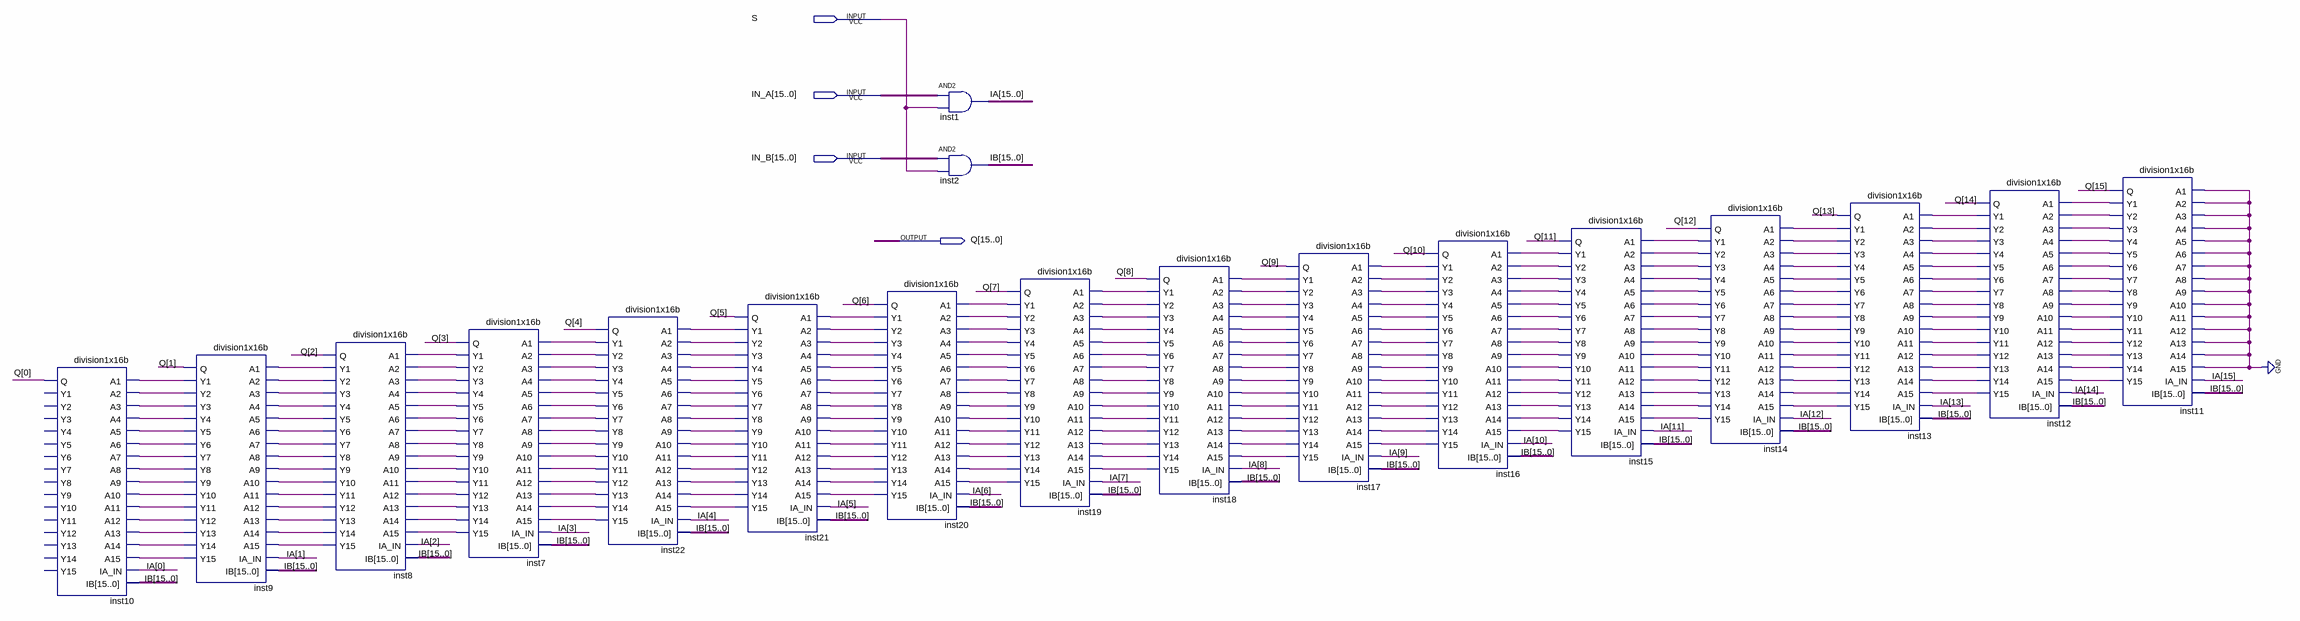
[diagram p0: schematic sheet]
// Quartus schematic division.bdf as structural Verilog: 18 symbols, 4 pins
module division (
  input  S,
  input  [15:0] IN_A,
  input  [15:0] IN_B,
  output [15:0] Q
);

  wire inst7_y1, inst7_y2, inst7_y3, inst7_y4, inst7_y5, inst7_y6, inst7_y7, inst7_y8, inst7_y9, inst7_y10,
       inst7_y11, inst7_y12, inst7_y13, inst7_y14, inst7_y15, inst8_y1, inst8_y2, inst8_y3, inst8_y4,
       inst8_y5, inst8_y6, inst8_y7, inst8_y8, inst8_y9, inst8_y10, inst8_y11, inst8_y12, inst8_y13,
       inst8_y14, inst8_y15, inst9_y1, inst9_y2, inst9_y3, inst9_y4, inst9_y5, inst9_y6, inst9_y7, inst9_y8,
       inst9_y9, inst9_y10, inst9_y11, inst9_y12, inst9_y13, inst9_y14, inst9_y15, inst11_y1, inst11_y2,
       inst11_y3, inst11_y4, inst11_y5, inst11_y6, inst11_y7, inst11_y8, inst11_y9, inst11_y10, inst11_y11,
       inst11_y12, inst11_y13, inst11_y14, inst11_y15, inst12_y1, inst12_y2, inst12_y3, inst12_y4, inst12_y5,
       inst12_y6, inst12_y7, inst12_y8, inst12_y9, inst12_y10, inst12_y11, inst12_y12, inst12_y13,
       inst12_y14, inst12_y15, inst13_y1, inst13_y2, inst13_y3, inst13_y4, inst13_y5, inst13_y6, inst13_y7,
       inst13_y8, inst13_y9, inst13_y10, inst13_y11, inst13_y12, inst13_y13, inst13_y14, inst13_y15,
       inst14_y1, inst14_y2, inst14_y3, inst14_y4, inst14_y5, inst14_y6, inst14_y7, inst14_y8, inst14_y9,
       inst14_y10, inst14_y11, inst14_y12, inst14_y13, inst14_y14, inst14_y15, inst15_y1, inst15_y2,
       inst15_y3, inst15_y4, inst15_y5, inst15_y6, inst15_y7, inst15_y8, inst15_y9, inst15_y10, inst15_y11,
       inst15_y12, inst15_y13, inst15_y14, inst15_y15, inst16_y1, inst16_y2, inst16_y3, inst16_y4, inst16_y5,
       inst16_y6, inst16_y7, inst16_y8, inst16_y9, inst16_y10, inst16_y11, inst16_y12, inst16_y13,
       inst16_y14, inst16_y15, inst17_y1, inst17_y2, inst17_y3, inst17_y4, inst17_y5, inst17_y6, inst17_y7,
       inst17_y8, inst17_y9, inst17_y10, inst17_y11, inst17_y12, inst17_y13, inst17_y14, inst17_y15,
       inst18_y1, inst18_y2, inst18_y3, inst18_y4, inst18_y5, inst18_y6, inst18_y7, inst18_y8, inst18_y9,
       inst18_y10, inst18_y11, inst18_y12, inst18_y13, inst18_y14, inst18_y15, inst19_y1, inst19_y2,
       inst19_y3, inst19_y4, inst19_y5, inst19_y6, inst19_y7, inst19_y8, inst19_y9, inst19_y10, inst19_y11,
       inst19_y12, inst19_y13, inst19_y14, inst19_y15, inst20_y1, inst20_y2, inst20_y3, inst20_y4, inst20_y5,
       inst20_y6, inst20_y7, inst20_y8, inst20_y9, inst20_y10, inst20_y11, inst20_y12, inst20_y13,
       inst20_y14, inst20_y15, inst21_y1, inst21_y2, inst21_y3, inst21_y4, inst21_y5, inst21_y6, inst21_y7,
       inst21_y8, inst21_y9, inst21_y10, inst21_y11, inst21_y12, inst21_y13, inst21_y14, inst21_y15,
       inst22_y1, inst22_y2, inst22_y3, inst22_y4, inst22_y5, inst22_y6, inst22_y7, inst22_y8, inst22_y9,
       inst22_y10, inst22_y11, inst22_y12, inst22_y13, inst22_y14, inst22_y15;
  wire [15:0] IA, IB;

  division1x16b inst10 (
    .A1(inst9_y1), .A2(inst9_y2), .A3(inst9_y3), .A4(inst9_y4), .A5(inst9_y5), .A6(inst9_y6), .A7(inst9_y7),
    .A8(inst9_y8), .A9(inst9_y9), .A10(inst9_y10), .A11(inst9_y11), .A12(inst9_y12), .A13(inst9_y13),
    .A14(inst9_y14), .A15(inst9_y15), .IA_IN(IA[0]), .IB(IB), .Q(Q[0]));  // open: Y7, Y6, Y5, Y4, Y3, Y2, Y1, Y9, Y8, Y10, Y11, Y12, Y13, Y14, Y15
  division1x16b inst9 (
    .A1(inst8_y1), .A2(inst8_y2), .A3(inst8_y3), .A4(inst8_y4), .A5(inst8_y5), .A6(inst8_y6), .A7(inst8_y7),
    .A8(inst8_y8), .A9(inst8_y9), .A10(inst8_y10), .A11(inst8_y11), .A12(inst8_y12), .A13(inst8_y13),
    .A14(inst8_y14), .A15(inst8_y15), .IA_IN(IA[1]), .IB(IB), .Q(Q[1]), .Y7(inst9_y7), .Y6(inst9_y6),
    .Y5(inst9_y5), .Y4(inst9_y4), .Y3(inst9_y3), .Y2(inst9_y2), .Y1(inst9_y1), .Y9(inst9_y9), .Y8(inst9_y8),
    .Y10(inst9_y10), .Y11(inst9_y11), .Y12(inst9_y12), .Y13(inst9_y13), .Y14(inst9_y14), .Y15(inst9_y15));
  division1x16b inst8 (
    .A1(inst7_y1), .A2(inst7_y2), .A3(inst7_y3), .A4(inst7_y4), .A5(inst7_y5), .A6(inst7_y6), .A7(inst7_y7),
    .A8(inst7_y8), .A9(inst7_y9), .A10(inst7_y10), .A11(inst7_y11), .A12(inst7_y12), .A13(inst7_y13),
    .A14(inst7_y14), .A15(inst7_y15), .IA_IN(IA[2]), .IB(IB), .Q(Q[2]), .Y7(inst8_y7), .Y6(inst8_y6),
    .Y5(inst8_y5), .Y4(inst8_y4), .Y3(inst8_y3), .Y2(inst8_y2), .Y1(inst8_y1), .Y9(inst8_y9), .Y8(inst8_y8),
    .Y10(inst8_y10), .Y11(inst8_y11), .Y12(inst8_y12), .Y13(inst8_y13), .Y14(inst8_y14), .Y15(inst8_y15));
  division1x16b inst7 (
    .A1(inst22_y1), .A2(inst22_y2), .A3(inst22_y3), .A4(inst22_y4), .A5(inst22_y5), .A6(inst22_y6),
    .A7(inst22_y7), .A8(inst22_y8), .A9(inst22_y9), .A10(inst22_y10), .A11(inst22_y11), .A12(inst22_y12),
    .A13(inst22_y13), .A14(inst22_y14), .A15(inst22_y15), .IA_IN(IA[3]), .IB(IB), .Q(Q[3]), .Y7(inst7_y7),
    .Y6(inst7_y6), .Y5(inst7_y5), .Y4(inst7_y4), .Y3(inst7_y3), .Y2(inst7_y2), .Y1(inst7_y1), .Y9(inst7_y9),
    .Y8(inst7_y8), .Y10(inst7_y10), .Y11(inst7_y11), .Y12(inst7_y12), .Y13(inst7_y13), .Y14(inst7_y14),
    .Y15(inst7_y15));
  division1x16b inst22 (
    .A1(inst21_y1), .A2(inst21_y2), .A3(inst21_y3), .A4(inst21_y4), .A5(inst21_y5), .A6(inst21_y6),
    .A7(inst21_y7), .A8(inst21_y8), .A9(inst21_y9), .A10(inst21_y10), .A11(inst21_y11), .A12(inst21_y12),
    .A13(inst21_y13), .A14(inst21_y14), .A15(inst21_y15), .IA_IN(IA[4]), .IB(IB), .Q(Q[4]), .Y7(inst22_y7),
    .Y6(inst22_y6), .Y5(inst22_y5), .Y4(inst22_y4), .Y3(inst22_y3), .Y2(inst22_y2), .Y1(inst22_y1),
    .Y9(inst22_y9), .Y8(inst22_y8), .Y10(inst22_y10), .Y11(inst22_y11), .Y12(inst22_y12), .Y13(inst22_y13),
    .Y14(inst22_y14), .Y15(inst22_y15));
  division1x16b inst21 (
    .A1(inst20_y1), .A2(inst20_y2), .A3(inst20_y3), .A4(inst20_y4), .A5(inst20_y5), .A6(inst20_y6),
    .A7(inst20_y7), .A8(inst20_y8), .A9(inst20_y9), .A10(inst20_y10), .A11(inst20_y11), .A12(inst20_y12),
    .A13(inst20_y13), .A14(inst20_y14), .A15(inst20_y15), .IA_IN(IA[5]), .IB(IB), .Q(Q[5]), .Y7(inst21_y7),
    .Y6(inst21_y6), .Y5(inst21_y5), .Y4(inst21_y4), .Y3(inst21_y3), .Y2(inst21_y2), .Y1(inst21_y1),
    .Y9(inst21_y9), .Y8(inst21_y8), .Y10(inst21_y10), .Y11(inst21_y11), .Y12(inst21_y12), .Y13(inst21_y13),
    .Y14(inst21_y14), .Y15(inst21_y15));
  division1x16b inst20 (
    .A1(inst19_y1), .A2(inst19_y2), .A3(inst19_y3), .A4(inst19_y4), .A5(inst19_y5), .A6(inst19_y6),
    .A7(inst19_y7), .A8(inst19_y8), .A9(inst19_y9), .A10(inst19_y10), .A11(inst19_y11), .A12(inst19_y12),
    .A13(inst19_y13), .A14(inst19_y14), .A15(inst19_y15), .IA_IN(IA[6]), .IB(IB), .Q(Q[6]), .Y7(inst20_y7),
    .Y6(inst20_y6), .Y5(inst20_y5), .Y4(inst20_y4), .Y3(inst20_y3), .Y2(inst20_y2), .Y1(inst20_y1),
    .Y9(inst20_y9), .Y8(inst20_y8), .Y10(inst20_y10), .Y11(inst20_y11), .Y12(inst20_y12), .Y13(inst20_y13),
    .Y14(inst20_y14), .Y15(inst20_y15));
  assign IA = IN_A & {16{S}};  // AND2 inst1, 16 bits wide
  assign IB = IN_B & {16{S}};  // AND2 inst2, 16 bits wide
  division1x16b inst19 (
    .A1(inst18_y1), .A2(inst18_y2), .A3(inst18_y3), .A4(inst18_y4), .A5(inst18_y5), .A6(inst18_y6),
    .A7(inst18_y7), .A8(inst18_y8), .A9(inst18_y9), .A10(inst18_y10), .A11(inst18_y11), .A12(inst18_y12),
    .A13(inst18_y13), .A14(inst18_y14), .A15(inst18_y15), .IA_IN(IA[7]), .IB(IB), .Q(Q[7]), .Y7(inst19_y7),
    .Y6(inst19_y6), .Y5(inst19_y5), .Y4(inst19_y4), .Y3(inst19_y3), .Y2(inst19_y2), .Y1(inst19_y1),
    .Y9(inst19_y9), .Y8(inst19_y8), .Y10(inst19_y10), .Y11(inst19_y11), .Y12(inst19_y12), .Y13(inst19_y13),
    .Y14(inst19_y14), .Y15(inst19_y15));
  division1x16b inst18 (
    .A1(inst17_y1), .A2(inst17_y2), .A3(inst17_y3), .A4(inst17_y4), .A5(inst17_y5), .A6(inst17_y6),
    .A7(inst17_y7), .A8(inst17_y8), .A9(inst17_y9), .A10(inst17_y10), .A11(inst17_y11), .A12(inst17_y12),
    .A13(inst17_y13), .A14(inst17_y14), .A15(inst17_y15), .IA_IN(IA[8]), .IB(IB), .Q(Q[8]), .Y7(inst18_y7),
    .Y6(inst18_y6), .Y5(inst18_y5), .Y4(inst18_y4), .Y3(inst18_y3), .Y2(inst18_y2), .Y1(inst18_y1),
    .Y9(inst18_y9), .Y8(inst18_y8), .Y10(inst18_y10), .Y11(inst18_y11), .Y12(inst18_y12), .Y13(inst18_y13),
    .Y14(inst18_y14), .Y15(inst18_y15));
  division1x16b inst17 (
    .A1(inst16_y1), .A2(inst16_y2), .A3(inst16_y3), .A4(inst16_y4), .A5(inst16_y5), .A6(inst16_y6),
    .A7(inst16_y7), .A8(inst16_y8), .A9(inst16_y9), .A10(inst16_y10), .A11(inst16_y11), .A12(inst16_y12),
    .A13(inst16_y13), .A14(inst16_y14), .A15(inst16_y15), .IA_IN(IA[9]), .IB(IB), .Q(Q[9]), .Y7(inst17_y7),
    .Y6(inst17_y6), .Y5(inst17_y5), .Y4(inst17_y4), .Y3(inst17_y3), .Y2(inst17_y2), .Y1(inst17_y1),
    .Y9(inst17_y9), .Y8(inst17_y8), .Y10(inst17_y10), .Y11(inst17_y11), .Y12(inst17_y12), .Y13(inst17_y13),
    .Y14(inst17_y14), .Y15(inst17_y15));
  division1x16b inst16 (
    .A1(inst15_y1), .A2(inst15_y2), .A3(inst15_y3), .A4(inst15_y4), .A5(inst15_y5), .A6(inst15_y6),
    .A7(inst15_y7), .A8(inst15_y8), .A9(inst15_y9), .A10(inst15_y10), .A11(inst15_y11), .A12(inst15_y12),
    .A13(inst15_y13), .A14(inst15_y14), .A15(inst15_y15), .IA_IN(IA[10]), .IB(IB), .Q(Q[10]), .Y7(inst16_y7),
    .Y6(inst16_y6), .Y5(inst16_y5), .Y4(inst16_y4), .Y3(inst16_y3), .Y2(inst16_y2), .Y1(inst16_y1),
    .Y9(inst16_y9), .Y8(inst16_y8), .Y10(inst16_y10), .Y11(inst16_y11), .Y12(inst16_y12), .Y13(inst16_y13),
    .Y14(inst16_y14), .Y15(inst16_y15));
  division1x16b inst15 (
    .A1(inst14_y1), .A2(inst14_y2), .A3(inst14_y3), .A4(inst14_y4), .A5(inst14_y5), .A6(inst14_y6),
    .A7(inst14_y7), .A8(inst14_y8), .A9(inst14_y9), .A10(inst14_y10), .A11(inst14_y11), .A12(inst14_y12),
    .A13(inst14_y13), .A14(inst14_y14), .A15(inst14_y15), .IA_IN(IA[11]), .IB(IB), .Q(Q[11]), .Y7(inst15_y7),
    .Y6(inst15_y6), .Y5(inst15_y5), .Y4(inst15_y4), .Y3(inst15_y3), .Y2(inst15_y2), .Y1(inst15_y1),
    .Y9(inst15_y9), .Y8(inst15_y8), .Y10(inst15_y10), .Y11(inst15_y11), .Y12(inst15_y12), .Y13(inst15_y13),
    .Y14(inst15_y14), .Y15(inst15_y15));
  division1x16b inst14 (
    .A1(inst13_y1), .A2(inst13_y2), .A3(inst13_y3), .A4(inst13_y4), .A5(inst13_y5), .A6(inst13_y6),
    .A7(inst13_y7), .A8(inst13_y8), .A9(inst13_y9), .A10(inst13_y10), .A11(inst13_y11), .A12(inst13_y12),
    .A13(inst13_y13), .A14(inst13_y14), .A15(inst13_y15), .IA_IN(IA[12]), .IB(IB), .Q(Q[12]), .Y7(inst14_y7),
    .Y6(inst14_y6), .Y5(inst14_y5), .Y4(inst14_y4), .Y3(inst14_y3), .Y2(inst14_y2), .Y1(inst14_y1),
    .Y9(inst14_y9), .Y8(inst14_y8), .Y10(inst14_y10), .Y11(inst14_y11), .Y12(inst14_y12), .Y13(inst14_y13),
    .Y14(inst14_y14), .Y15(inst14_y15));
  division1x16b inst13 (
    .A1(inst12_y1), .A2(inst12_y2), .A3(inst12_y3), .A4(inst12_y4), .A5(inst12_y5), .A6(inst12_y6),
    .A7(inst12_y7), .A8(inst12_y8), .A9(inst12_y9), .A10(inst12_y10), .A11(inst12_y11), .A12(inst12_y12),
    .A13(inst12_y13), .A14(inst12_y14), .A15(inst12_y15), .IA_IN(IA[13]), .IB(IB), .Q(Q[13]), .Y7(inst13_y7),
    .Y6(inst13_y6), .Y5(inst13_y5), .Y4(inst13_y4), .Y3(inst13_y3), .Y2(inst13_y2), .Y1(inst13_y1),
    .Y9(inst13_y9), .Y8(inst13_y8), .Y10(inst13_y10), .Y11(inst13_y11), .Y12(inst13_y12), .Y13(inst13_y13),
    .Y14(inst13_y14), .Y15(inst13_y15));
  division1x16b inst12 (
    .A1(inst11_y1), .A2(inst11_y2), .A3(inst11_y3), .A4(inst11_y4), .A5(inst11_y5), .A6(inst11_y6),
    .A7(inst11_y7), .A8(inst11_y8), .A9(inst11_y9), .A10(inst11_y10), .A11(inst11_y11), .A12(inst11_y12),
    .A13(inst11_y13), .A14(inst11_y14), .A15(inst11_y15), .IA_IN(IA[14]), .IB(IB), .Q(Q[14]), .Y7(inst12_y7),
    .Y6(inst12_y6), .Y5(inst12_y5), .Y4(inst12_y4), .Y3(inst12_y3), .Y2(inst12_y2), .Y1(inst12_y1),
    .Y9(inst12_y9), .Y8(inst12_y8), .Y10(inst12_y10), .Y11(inst12_y11), .Y12(inst12_y12), .Y13(inst12_y13),
    .Y14(inst12_y14), .Y15(inst12_y15));
  division1x16b inst11 (
    .A1(1'b0), .A2(1'b0), .A3(1'b0), .A4(1'b0), .A5(1'b0), .A6(1'b0), .A7(1'b0), .A8(1'b0), .A9(1'b0),
    .A10(1'b0), .A11(1'b0), .A12(1'b0), .A13(1'b0), .A14(1'b0), .A15(1'b0), .IA_IN(IA[15]), .IB(IB),
    .Q(Q[15]), .Y7(inst11_y7), .Y6(inst11_y6), .Y5(inst11_y5), .Y4(inst11_y4), .Y3(inst11_y3),
    .Y2(inst11_y2), .Y1(inst11_y1), .Y9(inst11_y9), .Y8(inst11_y8), .Y10(inst11_y10), .Y11(inst11_y11),
    .Y12(inst11_y12), .Y13(inst11_y13), .Y14(inst11_y14), .Y15(inst11_y15));
endmodule
